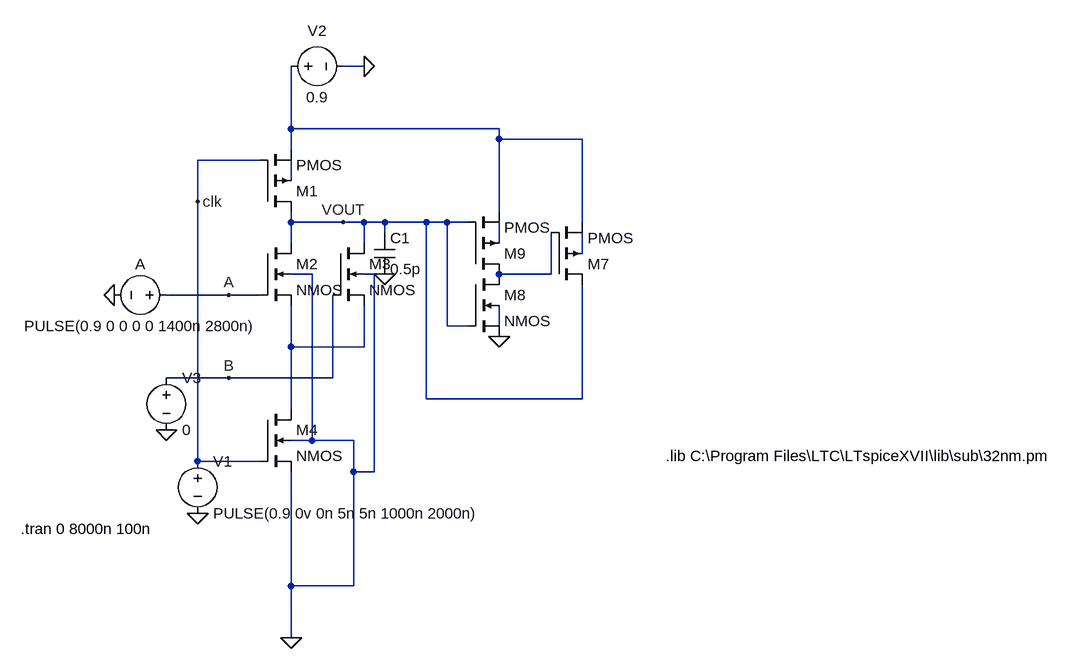
[diagram p0: schematic Dynamic_logic.asc]
Dynamic_logic.asc, the LTspice schematic file:
Version 4
SHEET 1 3808 2068
WIRE 256 -64 224 -64
WIRE 144 32 144 -64
WIRE 464 32 144 32
WIRE 464 48 464 32
WIRE 592 48 464 48
WIRE 144 64 144 32
WIRE 96 80 0 80
WIRE 144 112 144 80
WIRE 0 144 0 80
WIRE 464 160 464 48
WIRE 144 176 144 160
WIRE 224 176 144 176
WIRE 256 176 224 176
WIRE 288 176 256 176
WIRE 352 176 288 176
WIRE 384 176 352 176
WIRE 416 176 384 176
WIRE 592 176 592 48
WIRE 288 192 288 176
WIRE 144 208 144 176
WIRE 256 208 256 176
WIRE 464 208 464 176
WIRE 592 224 592 192
WIRE 176 256 144 256
WIRE 272 256 256 256
WIRE 544 256 544 192
WIRE 544 256 464 256
WIRE 48 288 -48 288
WIRE 96 288 48 288
WIRE 384 336 384 176
WIRE 416 336 384 336
WIRE 464 336 464 304
WIRE 144 368 144 304
WIRE 256 368 256 304
WIRE 256 368 144 368
WIRE 48 416 -48 416
WIRE 208 416 208 288
WIRE 208 416 48 416
WIRE 352 448 352 176
WIRE 592 448 592 272
WIRE 592 448 352 448
WIRE 144 464 144 368
WIRE 176 512 176 256
WIRE 176 512 144 512
WIRE 240 512 176 512
WIRE 0 544 0 144
WIRE 96 544 0 544
WIRE 240 560 240 512
WIRE 272 560 272 256
WIRE 272 560 240 560
WIRE 144 736 144 560
WIRE 240 736 240 560
WIRE 240 736 144 736
WIRE 144 816 144 736
FLAG 0 144 clk
FLAG 0 624 0
FLAG 144 816 0
FLAG 256 -64 0
FLAG -128 288 0
FLAG 48 288 A
FLAG 48 416 B
FLAG -48 496 0
FLAG 288 256 0
FLAG 464 352 0
FLAG 224 176 VOUT
SYMBOL pmos4 96 160 M180
SYMATTR InstName M1
SYMATTR Value2 l=32nm w=128u
SYMBOL nmos4 208 208 R0
SYMATTR InstName M3
SYMATTR Value2 l=32nm w=64nm
SYMBOL nmos4 96 464 R0
SYMATTR InstName M4
SYMATTR Value2 l=32nm w=64nm
SYMBOL voltage 0 528 R0
WINDOW 123 0 0 Left 0
WINDOW 39 0 0 Left 0
SYMATTR InstName V1
SYMATTR Value PULSE(0.9 0v 0n 5n 5n 1000n 2000n)
SYMBOL voltage 128 -64 R270
WINDOW 0 39 56 VTop 2
WINDOW 3 -32 56 VBottom 2
WINDOW 123 0 0 Left 0
WINDOW 39 0 0 Left 0
SYMATTR InstName V2
SYMATTR Value 0.9
SYMBOL voltage -32 288 R90
WINDOW 0 -32 56 VBottom 2
WINDOW 3 32 56 VTop 2
WINDOW 123 0 0 Left 0
WINDOW 39 0 0 Left 0
SYMATTR InstName A
SYMATTR Value PULSE(0.9 0 0 0 0 1400n 2800n)
SYMBOL nmos4 96 208 R0
SYMATTR InstName M2
SYMATTR Value2 l=32nm w=64nm
SYMBOL voltage -48 400 R0
SYMATTR InstName V3
SYMATTR Value 0
SYMBOL cap 272 192 R0
SYMATTR InstName C1
SYMATTR Value 0.5p
SYMBOL pmos4 544 272 M180
SYMATTR InstName M7
SYMATTR Value2 l=32n w=32n
SYMBOL nmos4 416 256 R0
SYMATTR InstName M8
SYMBOL pmos4 416 256 M180
SYMATTR InstName M9
TEXT -272 648 Left 2 !.tran 0 8000n 100n
TEXT 720 536 Left 2 !.lib C:\\Program Files\\LTC\\LTspiceXVII\\lib\\sub\\32nm.pm

The netlist it stands for:
* Dynamic_logic.asc
M1 VOUT clk N001 N002 PMOS l=32nm w=128u
M3 VOUT B N007 0 NMOS l=32nm w=64nm
M4 N007 clk 0 0 NMOS l=32nm w=64nm
V1 clk 0 PULSE(0.9 0v 0n 5n 5n 1000n 2000n)
V2 N001 0 0.9
V§A A 0 PULSE(0.9 0 0 0 0 1400n 2800n)
M2 VOUT A N007 0 NMOS l=32nm w=64nm
V3 B 0 0
C1 VOUT 0 0.5p
M7 VOUT N005 N001 N004 PMOS l=32n w=32n
M8 N005 VOUT 0 N006 NMOS
M9 N005 VOUT N001 N003 PMOS
.model NMOS NMOS
.model PMOS PMOS
.lib standard.mos
.tran 0 8000n 100n
.lib C:\Program Files\LTC\LTspiceXVII\lib\sub\32nm.pm
.backanno
.end